# EasyEDA Pro project ProPrj_降压模块_2026-05-07.epro

# Schematic Schematic1
Board Name: Board1; Create Date: 2025-04-08; Page Name: P1; Project Name: 降压模块; Schematic Name: Schematic1; Update Date: 2025-04-08; Company: 嘉立创EDA; Drawed: 林海鑫; Page Size: A4; Version: V1.0
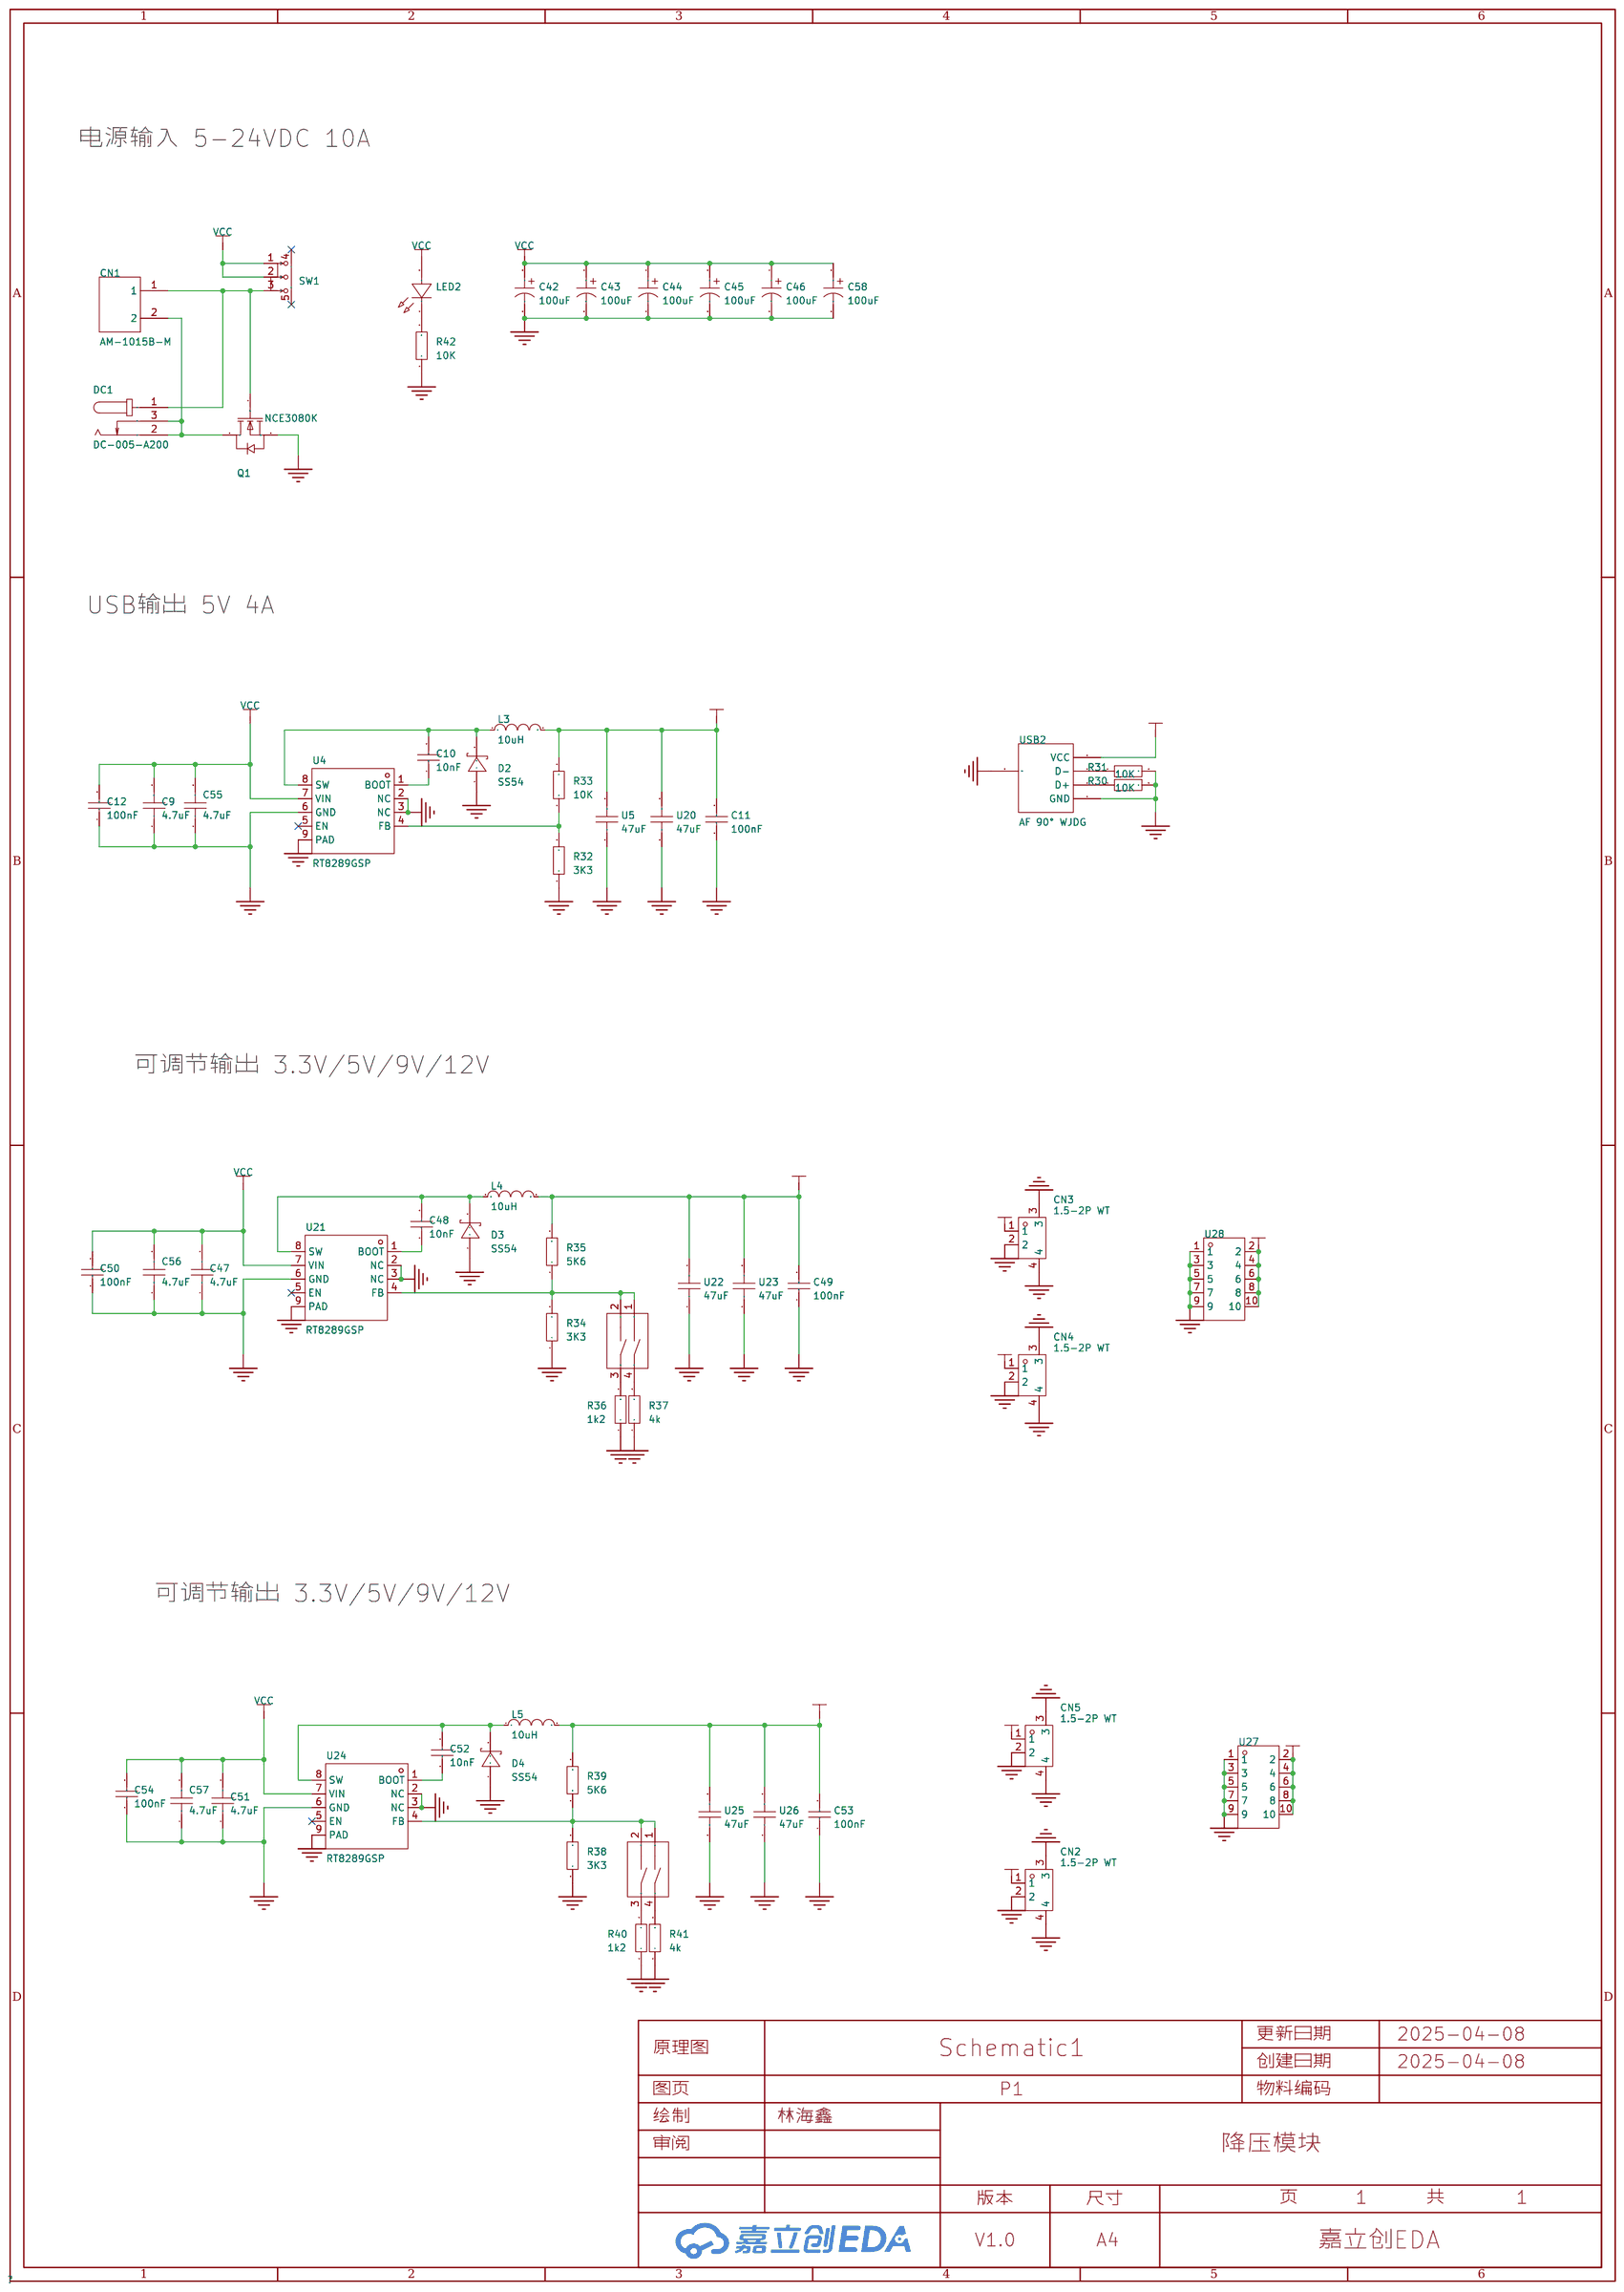
[diagram p0: schematic sheet]

## Parts
C9  4.7uF  [C1206]
C10  10nF  [C0603]
C11  100nF  [C0603]
C12  100nF  [C0603]
C42  100uF  [CAP-SMD_BD6.3-L6.6-W6.6-LS7.6-FD-1]
C43  100uF  [CAP-SMD_BD6.3-L6.6-W6.6-LS7.6-FD-1]
C44  100uF  [CAP-SMD_BD6.3-L6.6-W6.6-LS7.6-FD-1]
C45  100uF  [CAP-SMD_BD6.3-L6.6-W6.6-LS7.6-FD-1]
C46  100uF  [CAP-SMD_BD6.3-L6.6-W6.6-LS7.6-FD-1]
C47  4.7uF  [C1206]
C48  10nF  [C0603]
C49  100nF  [C0603]
C50  100nF  [C0603]
C51  4.7uF  [C1206]
C52  10nF  [C0603]
C53  100nF  [C0603]
C54  100nF  [C0603]
C55  4.7uF  [C1206]
C56  4.7uF  [C1206]
C57  4.7uF  [C1206]
C58  100uF  [CAP-SMD_BD6.3-L6.6-W6.6-LS7.6-FD-1]
CN1  AM-1015B-M  [CONN-TH_AM-1015B-M]
CN2  1.5-2P WT  [CONN-SMD_1.5-2P-WT]
CN3  1.5-2P WT  [CONN-SMD_1.5-2P-WT]
CN4  1.5-2P WT  [CONN-SMD_1.5-2P-WT]
CN5  1.5-2P WT  [CONN-SMD_1.5-2P-WT]
D2  SS54  [SMA_L4.4-W2.8-LS5.4-R-RD]
D3  SS54  [SMA_L4.4-W2.8-LS5.4-R-RD]
D4  SS54  [SMA_L4.4-W2.8-LS5.4-R-RD]
DC1  DC-005-A200  [DC-IN-TH_DC-005-A200]
L3  10uH  [IND-SMD_L7.3-W6.8]
L4  10uH  [IND-SMD_L7.3-W6.8]
L5  10uH  [IND-SMD_L7.3-W6.8]
LED2  XL-1608SURC-06  [LED0603-RD_RED]
Q1  NCE3080K  [TO-252-2_L6.6-W6.1-P4.57-LS9.9-TL-CW]
R30  10K  [R0603]
R31  10K  [R0603]
R32  3K3  [R0603]
R33  10K  [R0603]
R34  3K3  [R0603]
R35  5K6  [R0603]
R36  1k2  [R0603]
R37  4k  [R0603]
R38  3K3  [R0603]
R39  5K6  [R0603]
R40  1k2  [R0603]
R41  4k  [R0603]
R42  10K  [R0603]
SW1  SS-12D11L5  [SW-TH_SS-12D11L5]
SW2  DSHP02TSGER  [SW-SMD_DSHP02TSGER]
SW3  DSHP02TSGER  [SW-SMD_DSHP02TSGER]
U4  RT8289GSP  [SOIC-8_L5.0-W4.0-P1.27-LS6.0-BL-EP2.0]
U5  47uF  [C1206]
U20  47uF  [C1206]
U21  RT8289GSP  [SOIC-8_L5.0-W4.0-P1.27-LS6.0-BL-EP2.0]
U22  47uF  [C1206]
U23  47uF  [C1206]
U24  RT8289GSP  [SOIC-8_L5.0-W4.0-P1.27-LS6.0-BL-EP2.0]
U25  47uF  [C1206]
U26  47uF  [C1206]
U27  ZX-PZ2.54-2-5PZZ  [HDR-TH_10P-P2.54-V-M-R2-C5-S2.54]
U28  ZX-PZ2.54-2-5PZZ  [HDR-TH_10P-P2.54-V-M-R2-C5-S2.54]
USB2  AF 90° WJDG  [USB-A-TH_AF-WJDG]

## Library data of the parts
C9 C47 C51 C55-C57 = CL31B475KBHNNNE: 容值:4.7uF;精度:±10%;额定电压:50V;材质(温度系数):X7R;; LCSC Part Name: 4.7uF ±10% 50V; Supplier Part: C51205; Manufacturer: SAMSUNG(三星); Supplier Footprint: 1206; JLCPCB Part Class: Extended Part; Datasheet: https://atta.szlcsc.com/upload/public/pdf/source/20160218/1457707763339.pdf; Supplier: LCSC; Tolerance: ±10%; Voltage Rated: 50V; Temperature Coefficient: X7R
C10 C48 C52 = CC0603KRX7R9BB103: 容值:10nF;精度:±10%;额定电压:50V;材质(温度系数):X7R;; LCSC Part Name: 10nF ±10% 50V; Supplier Part: C100042; Manufacturer: YAGEO(国巨); Supplier Footprint: 0603; JLCPCB Part Class: Extended Part; Datasheet: https://atta.szlcsc.com/upload/public/pdf/source/20181008/C309510_22F155564471FAF6A489F7D68F34234E.pdf; Supplier: LCSC; Tolerance: ±10%; Voltage Rated: 50V; Temperature Coefficient: X7R
C11 C12 C49 C50 C53 C54 = CGA0603X7R104K500JT: 容值:100nF;精度:±10%;额定电压:50V;材质(温度系数):X7R;; LCSC Part Name: 100nF ±10% 50V; Supplier Part: C6119867; Manufacturer: HRE(芯声); Supplier Footprint: 0603; JLCPCB Part Class: Extended Part; Datasheet: https://atta.szlcsc.com/upload/public/pdf/source/20160218/1457707763339.pdf; Supplier: LCSC; Tolerance: ±10%; Voltage Rated: 50V; Temperature Coefficient: X7R
C42-C46 C58 = RVE100UF35V67RV0072: 容值:100uF;精度:±20%;额定电压:35V;纹波电流:230mA@120Hz;等效串联电阻:600mΩ@100kHz;; LCSC Part Name: 100uF ±20% 35V; Supplier Part: C2836437; Manufacturer: KNSCHA(科尼盛); Supplier Footprint: SMD,D6.3xL7.7mm; JLCPCB Part Class: 扩展库; Datasheet: https://atta.szlcsc.com/upload/public/pdf/source/20220719/B52EB46F8A1558448ED03D8B4CB3C24F.pdf; Supplier: LCSC; Tolerance: ±20%; Rated Voltage: 35V; Ripple Current: 230mA@120Hz; Equivalent Series Resistance(ESR): 600mΩ@100kHz; φD: 6.3mm; L: 7.7mm; Lifetime @ Temp: 2000hrs@105℃; Operating Temperature: -55℃~+105℃
CN1 = AM-1015B-M: 类别:-;类型1:-;; LCSC Part Name: AMASS(艾迈斯)电源连接器公头AM-1015B-M; Supplier Part: C90631; Manufacturer: AMASS(艾迈斯); JLCPCB Part Class: 扩展库; Datasheet: https://atta.szlcsc.com/upload/public/pdf/source/20161217/1481939174683.pdf; Supplier: LCSC; Brand: 艾迈斯; Type: T行插头; RatedVoltage: DC 500V; InterfaceType: 双公头; MetalMaterial: 铜镀金; InsulationMaterial: PA; RatedCurrent: 25A; RecommendedWireGauge: 12AWG; FlameRetardantGrade: UL94 V0; contact resistance: 0.45mΩ
CN2-CN5 = 1.5-2P WT: 插针结构:1x2P;间距:1.5mm;安装方式:卧贴;参考系列:ZH;总PIN数:2P;排数:1;每排PIN数:2;行距:-;额定电流:1A;工作温度范围:-25℃~+85℃;; Supplier Part: C2681533; Manufacturer: SHOU HAN(首韩); Supplier Footprint: SMD,P=1.5mm,卧贴; JLCPCB Part Class: Extended Part; Datasheet: https://atta.szlcsc.com/upload/public/pdf/source/20210107/C2681535_97741691CC21DAF8D9FC266F7E994B99.pdf; Supplier: LCSC; Pins Structure: 1x2P; Pitch: 1.5mm; Mounting Style: 卧贴; Reference Series: ZH; Number of Pins: 2P; Number of Rows: 1; Number of PINs Per Row: 2; Current Rating (Max): 1A; Operating Temperature Range: -25℃~+85℃
D2-D4 = SS54_C22452: 正向压降(Vf):550mV@5A;直流反向耐压(Vr):40V;平均整流电流(Io):5A;; LCSC Part Name: 电压:40V 电流:5A; Supplier Part: C22452; Manufacturer: MDD; Supplier Footprint: SMA(DO-214AC); JLCPCB Part Class: 基础库; Datasheet: https://atta.szlcsc.com/upload/public/pdf/source/20230314/529CD85F9B31F69841D3A079BC07E377.pdf; Supplier: LCSC; Forward Voltage (Vf@If): 550mV@5A; Reverse Voltage (Vr): 40V; Average Rectified Current (Io): 5A; Reverse Leakage Current (Ir): 1mA@40V
DC1 = DC-005-A200: 连接器类型:DC电源插座;安装方式:弯插;触点内径:2mm;触点外径:6.4mm;额定电流:3A;额定电压:30V;工作温度范围:-20℃~+70℃;; LCSC Part Name: DC电源插座 内径:2mm 外径:6.4mm; Supplier Part: C720557; Manufacturer: XUNPU(讯普); Supplier Footprint: 插件; JLCPCB Part Class: 扩展库; Datasheet: https://atta.szlcsc.com/upload/public/pdf/source/20200812/C720557_2286DFCD6C75B71AF905731F627ABF3A.pdf; Supplier: LCSC; Connector Type: DC电源插座; Mounting Style: 弯插; Inside Contact Diameter: 2mm; Outside Contact Diameter: 6.4mm; Current Rating (Max): 3A; Voltage Rating (Max): 30V; Operating Temperature Range: -20℃~+70℃
L3-L5 = FXL0630-100-M: 电感值:10uH;精度:±20%;额定电流:4.5A;饱和电流(Isat):5.5A;类型:一体成型电感;; LCSC Part Name: 10uH ±20% 5.5A; Supplier Part: C167223; Manufacturer: cjiang(长江微电); Supplier Footprint: SMD,6.6x7mm; JLCPCB Part Class: 扩展库; Datasheet: https://atta.szlcsc.com/upload/public/pdf/source/20240426/3189EA8206330E2108542F9E34E540E7.pdf; Supplier: LCSC; Tolerance: ±20%; Rated Current: 4.5A; Saturation Current (Isat): 5.5A; DC Resistance (DCR): 68mΩ; Type: 一体成型电感
LED2 = XL-1608SURC-06: 发光颜色:红色;功率:55mW;正向电流:25mA;主波长:617nm~621nm;透镜颜色:无色透明透镜;色温:-;发光角度:120°;载带方式:正贴;工作温度:-30℃~+85℃;; Supplier Part: C965799; Manufacturer: XINGLIGHT(成兴光); Supplier Footprint: 0603; JLCPCB Part Class: 扩展库; Datasheet: https://atta.szlcsc.com/upload/public/pdf/source/20221102/D860AFDD1CDB02C5A8064103A32707E2.pdf; Supplier: LCSC; Emitted Color: 红色; Power Dissipation: 55mW; Forward Current: 25mA; Dominant Wavelength: 617nm~621nm; Peak Wavelength: 623nm; Lens Color: 无色透明透镜; Viewing Angle: 120°; Mounting Sytle: 正贴; Operating Temperature: -30℃~+85℃
Q1 = NCE3080K: 类型:N沟道;漏源电压(Vdss):30V;连续漏极电流(Id):80A;功率(Pd):83W;导通电阻(RDS(on)@Vgs,Id):6.5mΩ@10V,30A;阈值电压(Vgs(th)@Id):3V@250uA;; LCSC Part Name: N沟道 耐压:30V 电流:80A; Supplier Part: C108901; Manufacturer: NCE(无锡新洁能); Supplier Footprint: TO-252-2(DPAK); JLCPCB Part Class: 扩展库; Datasheet: https://atta.szlcsc.com/upload/public/pdf/source/20170505/1493957853878.pdf; Supplier: LCSC; Type: N沟道; Drain Source Voltage (Vdss): 30V; Continuous Drain Current (Id): 80A; Power Dissipation (Pd): 83W; Drain Source On Resistance (RDS(on)@Vgs,Id): 6.5mΩ@10V,30A; Gate Threshold Voltage (Vgs(th)@Id): 3V@250uA
R30-R42 = Res_0603: Supplier Footprint: 0603
SW1 = SS-12D11L5: 电路结构:单刀双掷;安装方式:侧插;开关颜色:黑色;额定电流(DC):3A;额定电压(DC):125V;额定电流(AC):3A;额定电压(AC):125V;机械寿命:1万次;; LCSC Part Name: 柄长5mm 卧插双档 滑动开关; Supplier Part: C319010; Manufacturer: XKB Connectivity(中国星坤); Supplier Footprint: 插件; JLCPCB Part Class: 扩展库; Datasheet: https://atta.szlcsc.com/upload/public/pdf/source/20211009/84F89DEF741E27E9E55DE4039DC07CAD.pdf; Supplier: LCSC; Circuit: 单刀双掷; Actuator Style: 矩形柱状; Pin Style: PC引脚; Switch Length: 13.5mm; Switch Width: 6.6mm; Switch Height: 6.3mm; Mounting Style: 侧插; Actuator Color: 黑色; Current Rating (DC): 3A; Voltage Rating (DC): 125V; Current Rating (AC): 3A; Voltage Rating (AC): 125V; Mechanical Life: 1万次; Operating Temperature: -40℃~+85℃
SW2 SW3 = DSHP02TSGER_C3293142: 电路结构:单刀单掷;开关位数:2位;额定电流:25mA;额定电压:24V;使用寿命:3千次;颜色:黑色;; LCSC Part Name: 2位 1.27mm间距贴片型 KE拨码开关 编码开关; Supplier Part: C3293142; Manufacturer: 康深; Supplier Footprint: SMD-4P,4.1x5.4mm; JLCPCB Part Class: 扩展库; Datasheet: https://atta.szlcsc.com/upload/public/pdf/source/20220713/5EFC25369A61FE3CF74296177B6F914F.pdf; Supplier: LCSC; Circuit: 单刀单掷; Number of Positions: 2位; Lead Pitch: 1.27mm; Current Rating: 25mA; Voltage Rating: 24V; Operating Temperature: -30℃~+85℃; Operating Life: 3千次; Color: 黑色
U4 U21 U24 = RT8289GSP: 功能类型:降压型;输出类型:可调;输入电压:5.5V~32V;输出电压:1.222V~26V;输出电流(最大值):5A;; Supplier Part: C39202; Manufacturer: RICHTEK(立锜); Supplier Footprint: SOIC-8-EP; JLCPCB Part Class: 扩展库; Datasheet: https://atta.szlcsc.com/upload/public/pdf/source/20141219/1457707253176.pdf; Supplier: LCSC; Function: 降压型; Output Type: 可调; Input Voltage: 5.5V~32V; Output Voltage: 1.222V~26V; Output Current (Max): 5A; Switching Frequency: 500kHz; Operating Temperature: -40℃~+85℃@(TA); Synchronous Rectification: 否; Number of Outputs: 1; Topology: 降压式; Switch tube (built-in/external): 内置
U5 U20 U22 U23 U25 U26 = CL31A476MPHNNNE: 容值:47uF;精度:±20%;额定电压:10V;材质(温度系数):X5R;; LCSC Part Name: 47uF ±20% 10V; Supplier Part: C96123; Manufacturer: SAMSUNG(三星); Supplier Footprint: 1206; JLCPCB Part Class: Basic Part; Datasheet: https://atta.szlcsc.com/upload/public/pdf/source/20160218/1457707763339.pdf; Supplier: LCSC; Tolerance: ±20%; Voltage Rated: 10V; Temperature Coefficient: X5R
U27 U28 = ZX-PZ2.54-2-5PZZ: 插针结构:2x5P;间距:2.54mm;行距:2.54mm;圆针/方针:方针;安装类型:直插;排数:双排;总PIN位数:10P;额定电流:3A;额定电压:1kV;配合针长度:6mm;塑高:2.5mm;端接针长度:3mm;触头材质:黄铜;触头镀层:金;工作温度范围:-40℃~+105℃;焊接温度(最大值):-;颜色:黑色;; LCSC Part Name: 2x5P 间距:2.54mm 方针 直插; Supplier Part: C7501276; Manufacturer: Megastar(兆星); Supplier Footprint: 插件,P=2.54mm; JLCPCB Part Class: Extended Part; Datasheet: https://atta.szlcsc.com/upload/public/pdf/source/20231122/7DD2FA5A7FDBC10CDDB6051CB6BC6AD1.pdf; Supplier: LCSC; Pin Structure: 2x5P; Pitch: 2.54mm; Row Spacing: 2.54mm; Circluar Pins/Square Pins: 方针; Mounting Type: 直插; Number of Rows: 双排; Number of Pins: 10P; Current Rating (Max): 3A; Voltage Rating (Max): 1kV; Length of Mating Pin: 6mm; Insulation Height: 2.5mm; Length of End Connection Pin: 3mm; Contact Material: 黄铜; Contact Plating: 金; Operating Temperature Range: -40℃~+105℃; Color: 黑色
USB2 = AF 90° WJDG: 连接器类型:Type-A;标准:USB 2.0;公母:母;端口数量:1;触点数量:4P;安装方式:弯插;额定电流 - 电源:1.5A;工作温度范围:-25℃~+85℃;; LCSC Part Name: Type-A 母 弯插; Supplier Part: C456018; Manufacturer: SHOU HAN(首韩); Supplier Footprint: 插件; JLCPCB Part Class: 扩展库; Datasheet: https://atta.szlcsc.com/upload/public/pdf/source/20191113/C456018_B104E062BEB8E11E57E63560E04EE13A.pdf; Supplier: LCSC; Connector Type: Type-A; Standard: USB 2.0; Gender: 母; Number of Ports: 1; Number of Contacts: 4P; Mounting Style: 弯插; Current Rating - Power (Max): 1.5A; Operating Temperature Range: -25℃~+85℃

## Nets
5V_USB: C11.2 L3.2 R33.2 U5.2 U20.2 USB2.1(VCC)
GND: C9.1 C11.1 C12.1 C42.2 C43.2 C44.2 C45.2 C46.2 C47.1 C49.1 C50.1 C51.1 C53.1 C54.1 C55.1 C56.1 C57.1 C58.2 CN2.2 CN2.3 CN2.4 CN3.2 CN3.3 CN3.4 CN4.2 CN4.3 CN4.4 CN5.2 CN5.3 CN5.4 D2.1(A) D3.1(A) D4.1(A) Q1.3(S) R30.2 R31.2 R32.1 R34.1 R36.1 R37.1 R38.1 R40.1 R41.1 R42.1 U4.2(NC) U4.3(NC) U4.6(GND) U4.9(PAD) U5.1 U20.1 U21.2(NC) U21.3(NC) U21.6(GND) U21.9(PAD) U22.1 U23.1 U24.2(NC) U24.3(NC) U24.6(GND) U24.9(PAD) U25.1 U26.1 U27.1 U27.3 U27.5 U27.7 U27.9 U28.1 U28.3 U28.5 U28.7 U28.9 USB2.4(GND) USB2.5(SHLD)
VCC: C9.2 C12.2 C42.1 C43.1 C44.1 C45.1 C46.1 C47.2 C50.2 C51.2 C54.2 C55.2 C56.2 C57.2 C58.1 LED2.2(A) SW1.1 SW1.2 U4.7(VIN) U21.7(VIN) U24.7(VIN)
VOUT1: C49.2 CN3.1 CN4.1 L4.2 R35.2 U22.2 U23.2 U28.2 U28.4 U28.6 U28.8 U28.10
VOUT2: C53.2 CN2.1 CN5.1 L5.2 R39.2 U25.2 U26.2 U27.2 U27.4 U27.6 U27.8 U27.10
$1N564: C10.2 D2.2(K) L3.1 U4.8(SW)
$1N565: C10.1 U4.1(BOOT)
$1N567: R32.2 R33.1 U4.4(FB)
$1N2303: R30.1 USB2.2(D-)
$1N2305: R31.1 USB2.3(D+)
$1N2402: CN1.2 DC1.2 DC1.3 Q1.2(D)
$1N3604: C48.2 D3.2(K) L4.1 U21.8(SW)
$1N3605: C48.1 U21.1(BOOT)
$1N3723: R34.2 R35.1 SW2.1 SW2.2 U21.4(FB)
$1N4431: C52.2 D4.2(K) L5.1 U24.8(SW)
$1N4432: C52.1 U24.1(BOOT)
$1N4442: R38.2 R39.1 SW3.1 SW3.2 U24.4(FB)
$1N7399: CN1.1 DC1.1 Q1.1(G) SW1.3
$1N8296: R40.2 SW3.3
$1N8298: R41.2 SW3.4
$1N8344: R36.2 SW2.3
$1N8346: R37.2 SW2.4
$1N8653: LED2.1(K) R42.2

Not connected (* = marked no-connect by the designer): SW1 4* 5*; U4 5(EN)*; U21 5(EN)*; U24 5(EN)*

## Notes on the sheet
- 电源输入 5-24VDC 10A
- USB输出 5V 4A
- 可调节输出 3.3V/5V/9V/12V
- 可调节输出 3.3V/5V/9V/12V

# Board PCB1
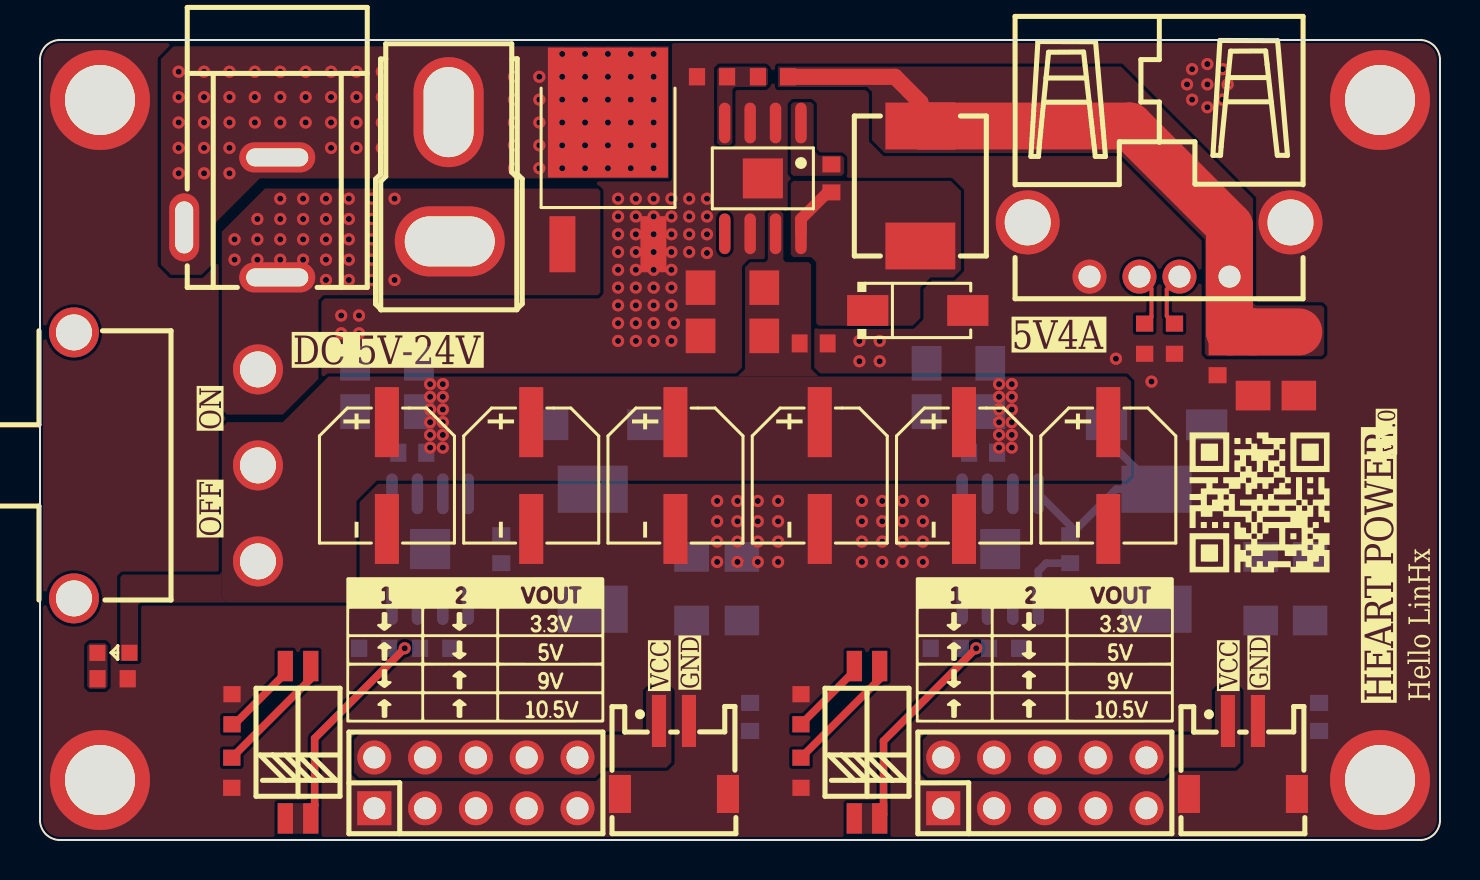
[diagram p1: board, top side]
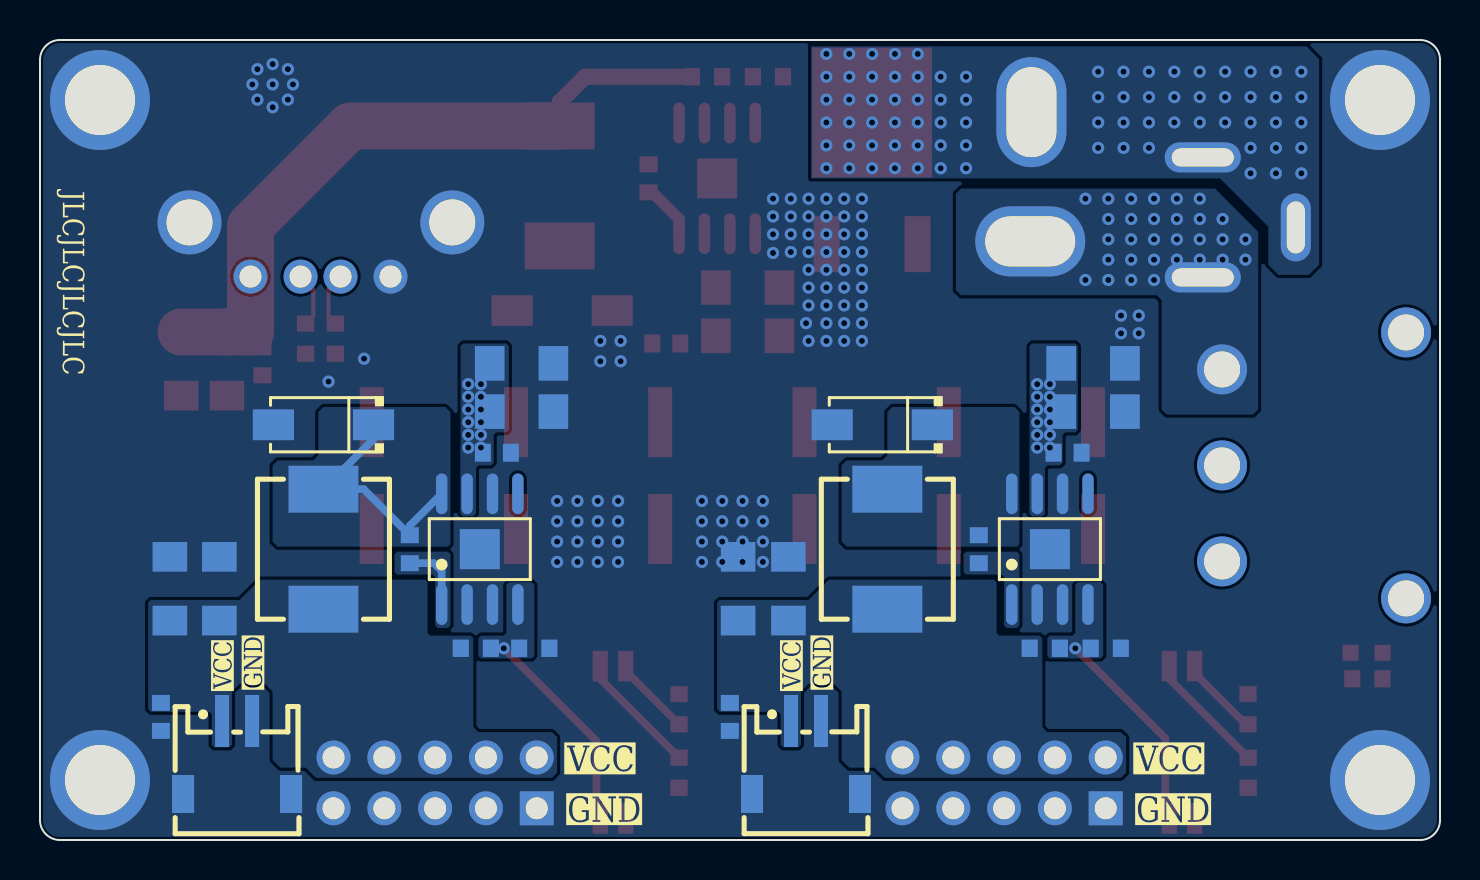
[diagram p2: board, bottom side, seen from below]

Outline 70 x 40 mm; copper layers: Top Layer, Bottom Layer. Coordinates in mm from the lower left corner of the outline.
Outline path: 0,39 arc(0.29,39.71) 1,40 69,40 arc(69.71,39.71) 70,39 70,1 arc(69.71,0.29) 69,0 1,0 arc(0.29,0.29) 0,1 0,39
Stack: Top Layer 0.035mm - / Dielectric1 1.51mm FR4 er 4.5 / Bottom Layer 0.035mm -

## Design rules (mm)
net $1N2305: DP1
net $1N2303: DP1
template: 自定义配置
spacing copperThickness1oz (default): track to track 0.102, other pairs 0.152 to 0.3
spacing copperThickness2oz: track to track 0.203, other pairs 0.152 to 0.3
track width copperThickness1oz (default): min 0.127, default 0.254, max 2.54
track width copperThickness2oz: min 0.203, default 0.254, max 2.54
differential pair differentialPair (default): width min 0.127, default 0.254, max 2.54; gap min 0.152, default 0.152
via viaSize (default): diameter min 0.5, default 0.61, max 10; hole min 0.3, default 0.305, max 6.3
pour e767 uses copperRegion

## Placement (name value [footprint] x y rotation side)
C9  4.7uF  [C1206]  34.62 25.21 0 top
C10  10nF  [C0603]  39.57 33.08 270 top
C11  100nF  [C0603]  58.88 23.94 90 top
C12  100nF  [C0603]  38.68 24.83 180 top
C42  100uF  [CAP-SMD_BD6.3-L6.6-W6.6-LS7.6-FD-1]  46.2 18.22 270 top
C43  100uF  [CAP-SMD_BD6.3-L6.6-W6.6-LS7.6-FD-1]  24.56 18.22 270 top
C44  100uF  [CAP-SMD_BD6.3-L6.6-W6.6-LS7.6-FD-1]  31.77 18.22 270 top
C45  100uF  [CAP-SMD_BD6.3-L6.6-W6.6-LS7.6-FD-1]  17.35 18.22 270 top
C46  100uF  [CAP-SMD_BD6.3-L6.6-W6.6-LS7.6-FD-1]  38.99 18.22 270 top
C47  4.7uF  [C1206]  45.92 21.42 0 bottom
C48  10nF  [C0603]  51.51 14.54 90 bottom
C49  100nF  [C0603]  63.96 6.16 90 bottom
C50  100nF  [C0603]  47.16 19.36 0 bottom
C51  4.7uF  [C1206]  17.35 21.42 0 bottom
C52  10nF  [C0603]  23.06 14.54 90 bottom
C53  100nF  [C0603]  35.51 6.16 90 bottom
C54  100nF  [C0603]  18.62 19.36 0 bottom
C55  4.7uF  [C1206]  34.62 27.62 0 top
C56  4.7uF  [C1206]  45.92 23.83 0 bottom
C57  4.7uF  [C1206]  17.35 23.83 0 bottom
C58  100uF  [CAP-SMD_BD6.3-L6.6-W6.6-LS7.6-FD-1]  53.41 18.22 270 top
CN1  AM-1015B-M  [CONN-TH_AM-1015B-M]  20.46 33.16 90 top
CN2  1.5-2P WT  [CONN-SMD_1.5-2P-WT]  31.7 4.13 180 top
CN3  1.5-2P WT  [CONN-SMD_1.5-2P-WT]  60.15 4.12 0 bottom
CN4  1.5-2P WT  [CONN-SMD_1.5-2P-WT]  60.15 4.12 180 top
CN5  1.5-2P WT  [CONN-SMD_1.5-2P-WT]  31.7 4.13 0 bottom
D2  SS54  [SMA_L4.4-W2.8-LS5.4-R-RD]  43.89 26.48 0 top
D3  SS54  [SMA_L4.4-W2.8-LS5.4-R-RD]  55.83 20.76 0 bottom
D4  SS54  [SMA_L4.4-W2.8-LS5.4-R-RD]  27.89 20.76 0 bottom
DC1  DC-005-A200  [DC-IN-TH_DC-005-A200]  9.54 31.13 270 top
L3  10uH  [IND-SMD_L7.3-W6.8]  44.02 32.7 90 top
L4  10uH  [IND-SMD_L7.3-W6.8]  55.83 14.54 270 bottom
L5  10uH  [IND-SMD_L7.3-W6.8]  27.63 14.54 270 bottom
LED2  XL-1608SURC-06  [LED0603-RD_RED]  3.67 9.36 0 top
NOREF  -  [Pad_e680]  3 3 0 top
NOREF#2  -  [Pad_e681]  67 3 0 top
NOREF#3  -  [Pad_e679]  3 37 0 top
NOREF#4  -  [Pad_e678]  67 37 0 top
Q1  NCE3080K  [TO-252-2_L6.6-W6.1-P4.57-LS9.9-TL-CW]  28.4 33.08 90 top
R30  10K  [R0603]  56.72 25.07 270 top
R31  10K  [R0603]  55.23 25.07 270 top
R32  3K3  [R0603]  33.6 38.16 0 top
R33  10K  [R0603]  36.65 38.16 0 top
R34  3K3  [R0603]  45.29 9.59 0 bottom
R35  5K6  [R0603]  48.21 9.59 0 bottom
R36  1k2  [R0603]  38.05 3.36 90 top
R37  4k  [R0603]  38.05 6.54 270 top
R38  3K3  [R0603]  16.71 9.59 0 bottom
R39  5K6  [R0603]  19.76 9.59 0 bottom
R40  1k2  [R0603]  9.59 3.36 90 top
R41  4k  [R0603]  9.6 6.54 270 top
R42  10K  [R0603]  3.63 8.06 180 top
SW1  SS-12D11L5  [SW-TH_SS-12D11L5]  6.3 18.73 90 top
SW2  DSHP02TSGER  [SW-SMD_DSHP02TSGER]  41.35 4.89 0 top
SW3  DSHP02TSGER  [SW-SMD_DSHP02TSGER]  12.9 4.89 0 top
U4  RT8289GSP  [SOIC-8_L5.0-W4.0-P1.27-LS6.0-BL-EP2.0]  36.14 33.08 180 top
U5  47uF  [C1206]  62.94 23.81 90 top
U20  47uF  [C1206]  60.65 23.81 90 top
U21  RT8289GSP  [SOIC-8_L5.0-W4.0-P1.27-LS6.0-BL-EP2.0]  48.01 14.54 180 bottom
U22  47uF  [C1206]  61.03 12.56 270 bottom
U23  47uF  [C1206]  63.51 12.56 270 bottom
U24  RT8289GSP  [SOIC-8_L5.0-W4.0-P1.27-LS6.0-BL-EP2.0]  19.51 14.54 180 bottom
U25  47uF  [C1206]  35.1 12.56 270 bottom
U26  47uF  [C1206]  32.58 12.56 270 bottom
U27  ZX-PZ2.54-2-5PZZ  [HDR-TH_10P-P2.54-V-M-R2-C5-S2.54]  21.8 2.86 0 top
U28  ZX-PZ2.54-2-5PZZ  [HDR-TH_10P-P2.54-V-M-R2-C5-S2.54]  50.24 2.86 0 top
USB2  AF 90° WJDG  [USB-A-TH_AF-WJDG]  55.96 29.53 180 top

## Footprints (pads in the part's own frame, mm; a bottom-side part is the same pattern mirrored in y, then rotated)
C0603
  rect 0.8x0.9 smd: 1(-0.7,0) 2(0.7,0)
C1206
  rect 1.485x1.728 smd: 1(-1.593,0) 2(1.593,0)
CAP-SMD_BD6.3-L6.6-W6.6-LS7.6-FD-1
  rect 3.5x1.2 smd: 1(-2.67,0) 2(2.67,0)
CONN-SMD_1.5-2P-WT
  rect 0.7x2.6 smd: 1(0.75,-1.825) 2(-0.75,-1.825)
  rect 1.1x1.9 smd: 3(-2.7,1.825) 4(2.7,1.825)
CONN-TH_AM-1015B-M
  oval 3.5x5.5 hole 2.5x4.5: 1(-3.231,-0.029)
  oval 5.5x3.5 hole 4.5x2.5: 2(3.231,0.029)
DC-IN-TH_DC-005-A200
  oval 1.5x3.8 hole 0.9x3.1: 1(3,2.325) 2(-3,2.325)
  oval 3.4x1.5 hole 2.6x0.9: 3(0.5,-2.325)
HDR-TH_10P-P2.54-V-M-R2-C5-S2.54
  rect 1.7x1.7 hole 1.1: 1(-5.08,-1.27)
  round 1.7 hole 1.1: 2(-5.08,1.27) 3(-2.54,-1.27) 4(-2.54,1.27) 5(0,-1.27) 6(0,1.27) 7(2.54,-1.27) 8(2.54,1.27) 9(5.08,-1.27) 10(5.08,1.27)
IND-SMD_L7.3-W6.8
  rect 2.35x3.5 smd: 1(-3,0) 2(3,0)
LED0603-RD_RED
  rect 0.8x0.8 smd: 1(-0.799,-0.004) 2(0.799,0.004)
Pad_e678
  round 5 hole 3.5: 11(0,0)
Pad_e679
  round 5 hole 3.5: 12(0,0)
Pad_e680
  round 5 hole 3.5: 13(0,0)
Pad_e681
  round 5 hole 3.5: 14(0,0)
R0603
  rect 0.806x0.864 smd: 1(-0.753,0) 2(0.753,0)
SMA_L4.4-W2.8-LS5.4-R-RD
  rect 2.062x1.539 smd: 1(2.503,0) 2(-2.503,0)
SOIC-8_L5.0-W4.0-P1.27-LS6.0-BL-EP2.0
  oval 0.574x2.038 smd: 1(-1.905,-2.769) 2(-0.635,-2.769) 3(0.635,-2.769) 4(1.905,-2.769) 5(1.905,2.769) 6(0.635,2.769) 7(-0.635,2.769) 8(-1.905,2.769)
  rect 2x2 smd: 9(0,0)
SW-SMD_DSHP02TSGER
  rect 0.762x1.524 smd: 1(-0.635,-3.81) 2(0.635,-3.81) 3(0.635,3.81) 4(-0.635,3.81)
SW-TH_SS-12D11L5
  round 2.5 hole 1.8: 1(-4.8,-4.6) 2(0,-4.6) 3(4.8,-4.6) 4(-6.65,4.6) 5(6.65,4.6)
TO-252-2_L6.6-W6.1-P4.57-LS9.9-TL-CW
  rect 2.8x1.3 smd: 1(-3.292,2.273) 3(-3.292,-2.273)
  rect 6.5x6 smd: 2(3.292,0)
USB-A-TH_AF-WJDG
  round 1.7 hole 1.1: 1(-3.521,1.355) 2(-1.018,1.355) 3(0.981,1.355) 4(3.48,1.355)
  round 3.2 hole 2.3: 5(-6.57,-1.355) 5(6.57,-1.355)

## Nets
As in the schematic, except:
GND: C9.1 C11.1 C12.1 C42.2 C43.2 C44.2 C45.2 C46.2 C47.1 C49.1 C50.1 C51.1 C53.1 C54.1 C55.1 C56.1 C57.1 C58.2 CN2.2 CN2.3 CN2.4 CN3.2 CN3.3 CN3.4 CN4.2 CN4.3 CN4.4 CN5.2 CN5.3 CN5.4 D2.1 D3.1 D4.1 NOREF.13 NOREF#2.14 NOREF#3.12 NOREF#4.11 Q1.3 R30.2 R31.2 R32.1 R34.1 R36.1 R37.1 R38.1 R40.1 R41.1 R42.1 U4.2 U4.3 U4.6 U4.9 U5.1 U20.1 U21.2 U21.3 U21.6 U21.9 U22.1 U23.1 U24.2 U24.3 U24.6 U24.9 U25.1 U26.1 U27.1 U27.3 U27.5 U27.7 U27.9 U28.1 U28.3 U28.5 U28.7 U28.9 USB2.4 USB2.5

Pads without a net: SW1 4 5; U4 5; U21 5; U24 5

## Via types
v1: diameter 0.61, hole 0.305, Top Layer to Bottom Layer, 227 vias

## Routing (per net, layer and track width the routed paths; a pad name or vN(x,y) marks a point on that pad's centre or on a via; arc(x,y) is an arc through that point)
5V_USB: length 34.6
  Top Layer w0.807: L3.2 44.02,36.89 42.75,38.16 R33.2
  Top Layer w2.349: L3.2 54.48,35.7 59.48,30.7 USB2.1 59.48,25.4 U20.2 U5.2
GND:
  vias: v1(15.06,26.22) v1(15.06,25.33) v1(15.95,26.22) v1(15.95,25.33) v1(28.9,32.06) v1(28.9,31.18) v1(28.9,30.29) v1(28.9,29.4) v1(28.9,28.51) v1(28.9,27.62) v1(28.9,26.73) v1(28.9,25.84) v1(28.9,24.95) v1(29.79,32.06) v1(29.79,31.18) v1(29.79,30.29) v1(29.79,29.4) v1(29.79,28.51) v1(29.79,27.62) v1(29.79,26.73) v1(29.79,25.84) v1(29.79,24.95) v1(30.68,32.06) v1(30.68,31.18) v1(30.68,30.29) v1(30.68,29.4) v1(30.68,28.51) v1(30.68,27.62) v1(30.68,26.73) v1(30.68,25.84) v1(30.68,24.95) v1(31.57,32.06) v1(31.57,31.18) v1(31.57,30.29) v1(31.57,29.4) v1(31.57,28.51) v1(31.57,27.62) v1(31.57,26.73) v1(31.57,24.95) v1(31.7,25.84) v1(32.46,32.06) v1(32.46,31.18) v1(32.46,30.29) v1(32.46,29.4) v1(33.35,32.06) v1(33.35,31.18) v1(33.35,30.29) v1(33.35,29.35) v1(33.86,16.95) v1(33.86,15.94) v1(33.86,14.92) v1(33.86,13.9) v1(34.87,16.95) v1(34.87,15.94) v1(34.87,14.92) v1(34.87,13.9) v1(35.89,16.95) v1(35.89,15.94) v1(35.89,14.92) v1(35.89,13.9) v1(36.91,16.95) v1(36.91,15.94) v1(36.91,14.92) v1(36.91,13.9) v1(40.97,24.95) v1(40.97,23.94) v1(41.1,16.95) v1(41.1,15.94) v1(41.1,14.92) v1(41.1,13.9) v1(41.99,24.95) v1(41.99,23.94) v1(42.11,16.95) v1(42.11,15.94) v1(42.11,14.92) v1(42.11,13.9) v1(43.13,16.95) v1(43.13,15.94) v1(43.13,14.92) v1(43.13,13.9) v1(44.14,16.95) v1(44.14,15.94) v1(44.14,14.92) v1(44.14,13.9) v1(53.8,24.06) v1(55.57,22.92) v1(57.35,37.78) v1(57.61,38.54) v1(57.61,37.02) v1(58.37,38.8) v1(58.37,37.78) v1(58.37,36.64) v1(59.13,38.54) v1(59.13,37.02) v1(59.38,37.78)
VCC:
  vias: v1(19.51,22.79) v1(19.51,22.16) v1(19.51,21.52) v1(19.51,20.89) v1(19.51,20.25) v1(19.51,19.62) v1(20.14,22.79) v1(20.14,22.16) v1(20.14,21.52) v1(20.14,20.89) v1(20.14,20.25) v1(20.14,19.62) v1(47.95,22.79) v1(47.95,22.16) v1(47.95,21.52) v1(47.95,20.89) v1(47.95,20.25) v1(47.95,19.62) v1(48.59,22.79) v1(48.59,22.16) v1(48.59,21.52) v1(48.59,20.89) v1(48.59,20.25) v1(48.59,19.62)
$1N564: length 2.7
  Top Layer w0.574: U4.8 38.05,31.05 39.38,32.38 39.44,32.38
$1N2303: length 2.8
  Top Layer w0.203: USB2.2 56.34,27.53 56.34,26.21 R30.1
$1N2305: length 2.7
  Top Layer w0.203: USB2.3 55.57,27.57 55.57,26.16 R31.1
$1N2402:
  vias: v1(6.93,38.42) v1(6.93,37.14) v1(6.93,35.88) v1(6.93,34.61) v1(6.93,33.33) v1(8.2,38.42) v1(8.2,37.14) v1(8.2,35.88) v1(8.2,34.61) v1(8.2,33.33) v1(9.47,38.42) v1(9.47,37.14) v1(9.47,35.88) v1(9.47,34.61) v1(9.47,33.33) v1(10.74,38.42) v1(10.74,37.14) v1(10.74,35.88) v1(12.01,38.42) v1(12.01,37.14) v1(12.01,35.88) v1(13.28,38.42) v1(13.28,37.14) v1(13.28,35.88) v1(14.55,38.42) v1(14.55,37.14) v1(14.55,35.88) v1(14.55,34.61) v1(15.82,38.42) v1(15.82,37.14) v1(15.82,35.88) v1(15.82,34.61) v1(17.09,38.42) v1(17.09,37.14) v1(17.09,35.88) v1(17.09,34.61) v1(23.7,38.16) v1(23.7,37.02) v1(23.7,35.88) v1(23.7,34.73) v1(23.7,33.59) v1(24.97,38.16) v1(24.97,37.02) v1(24.97,35.88) v1(24.97,34.73) v1(24.97,33.59) v1(26.11,39.3) v1(26.11,38.16) v1(26.11,37.02) v1(26.11,35.88) v1(26.11,34.73) v1(26.11,33.59) v1(27.25,39.3) v1(27.25,38.16) v1(27.25,37.02) v1(27.25,35.88) v1(27.25,34.73) v1(27.25,33.59) v1(28.4,39.3) v1(28.4,38.16) v1(28.4,37.02) v1(28.4,35.88) v1(28.4,34.73) v1(28.4,33.59) v1(29.54,39.3) v1(29.54,38.16) v1(29.54,37.02) v1(29.54,35.88) v1(29.54,34.73) v1(29.54,33.59) v1(30.68,39.3) v1(30.68,38.16) v1(30.68,37.02) v1(30.68,35.88) v1(30.68,34.73) v1(30.68,33.59)
$1N3604: length 12.3
  Bottom Layer w0.381: U21.8 51.51,15.72 C48.2 53.81,17.54 L4.1 53.32,20.04 D3.2
$1N3605: length 3.4
  Bottom Layer w0.381: C48.1 50.3,13.84 49.91,13.45 U21.1
$1N3723: length 10.5
  Top Layer w0.381: v1(46.81,9.59) 42.18,4.95 42.18,1.27 SW2.2
$1N4442: length 10
  Top Layer w0.381: v1(18.24,9.59) 13.73,5.08 13.73,1.72 13.55,1.54
$1N7399:
  vias: v1(9.73,30.03) v1(9.73,29.02) v1(10.87,31.05) v1(10.87,30.03) v1(10.87,29.02) v1(12.01,32.06) v1(12.01,31.05) v1(12.01,30.03) v1(12.01,29.02) v1(13.16,32.06) v1(13.16,31.05) v1(13.16,30.03) v1(13.16,29.02) v1(14.3,32.06) v1(14.3,31.05) v1(14.3,30.03) v1(14.3,29.02) v1(14.3,28) v1(15.44,32.06) v1(15.44,31.05) v1(15.44,30.03) v1(15.44,29.02) v1(15.44,28) v1(16.59,32.06) v1(16.59,31.05) v1(16.59,30.03) v1(16.59,29.02) v1(16.59,28) v1(17.73,32.06) v1(17.73,28)
$1N8296: length 6.3
  Top Layer w0.381: 9.59,4.12 13.65,8.18 13.65,8.58 SW3.3
$1N8298: length 4.1
  Top Layer w0.381: SW3.4 12.27,8.34 9.72,5.78 R41.2
$1N8344: length 6.3
  Top Layer w0.381: SW2.3 42.06,8.62 42.06,8.13 R36.2
$1N8346: length 4.1
  Top Layer w0.381: R37.2 40.84,8.57 SW2.4

## Copper pours and planes (outline as drawn; the poured copper is in the pictures)
5V_USB on Top Layer: 36.91,38.67 64.21,38.67 64.21,24.19 36.91,24.19
GND on Top Layer: 35,36.89 37.29,36.89 37.29,29.14 35,29.14
GND on Top Layer: 15.7,7.55 35.13,7.55 35.13,0.31 15.7,0.31
GND on Top Layer: 44.14,7.55 63.57,7.55 63.57,0.31 44.14,0.31
GND on Top Layer: 14.17,34.48 35.13,34.48 35.13,23.43 14.17,23.43
GND on Top Layer: 31.82,39.69 33.48,39.69 33.48,34.48 31.82,34.48
GND on Top Layer: 47.06,33.33 51.64,33.33 51.64,28.64 47.06,28.64
GND on Top Layer: 59.51,23.94 64.08,23.94 64.08,20.76 59.51,20.76
GND on Top Layer: 50.88,29.53 53.67,29.53 53.67,26.6 50.88,26.6
GND on Top Layer: 16.08,17.71 54.56,17.71 54.56,13.27 16.08,13.27
GND on Top Layer: 0,39 0.29,39.71 1,40 69,40 69.71,39.71 70,39 70,1 69.71,0.29 69,0 1,0 0.29,0.29 0,1
GND on Bottom Layer: 0,39 0.29,39.71 1,40 69,40 69.71,39.71 70,39 70,1 69.71,0.29 69,0 1,0 0.29,0.29 0,1
GND on Bottom Layer: 31.32,15.43 36.52,15.43 36.52,12.89 31.32,12.89
GND on Bottom Layer: 44.14,6.16 64.59,6.16 64.59,0.31 44.14,0.31
GND on Bottom Layer: 46.94,18.48 49.22,18.48 49.22,10.6 46.94,10.6
GND on Bottom Layer: 59.89,15.3 64.84,15.3 64.84,13.02 59.89,13.02
GND on Bottom Layer: 58.62,7.55 60.4,7.55 60.4,3.87 58.62,3.87
GND on Bottom Layer: 15.7,6.16 36.14,6.16 36.14,0.31 15.7,0.31
GND on Bottom Layer: 18.49,18.48 20.78,18.48 20.78,10.6 18.49,10.6
GND on Bottom Layer: 30.17,7.55 31.95,7.55 31.95,3.87 30.17,3.87
GND on Bottom Layer: 43.38,24.83 45.79,24.83 45.79,20.13 43.38,20.13
VCC on Top Layer: 9.09,23.17 54.56,23.17 54.56,11.87 9.09,11.87
VCC on Top Layer: 36.4,31.43 37.16,31.43 37.16,26.73 36.4,26.73
VCC on Top Layer: 34.87,31.43 38.94,31.43 38.94,23.17 34.87,23.17
VCC on Top Layer: 4.01,13.4 9.35,13.4 9.35,8.95 4.01,8.95
VCC on Bottom Layer: 18.11,24.83 20.52,24.83 20.52,16.19 18.11,16.19
VCC on Bottom Layer: 19.76,19.75 20.52,19.75 20.52,16.19 19.76,16.19
VCC on Bottom Layer: 48.21,19.75 48.97,19.75 48.97,16.19 48.21,16.19
VCC on Bottom Layer: 46.56,24.83 48.97,24.83 48.97,16.19 46.56,16.19
VOUT1 on Top Layer: 44.14,7.55 60.02,7.55 60.02,3.11 44.14,3.11
VOUT1 on Bottom Layer: 44.14,13.02 64.59,13.02 64.59,3.11 44.14,3.11
VOUT1 on Bottom Layer: 48.08,13.02 54.18,13.02 54.18,5.39 48.08,5.39
VOUT2 on Top Layer: 15.7,7.55 31.57,7.55 31.57,3.11 15.7,3.11
VOUT2 on Bottom Layer: 19.63,13.02 25.73,13.02 25.73,5.39 19.63,5.39
VOUT2 on Bottom Layer: 15.7,13.02 36.14,13.02 36.14,3.11 15.7,3.11
$1N564 on Top Layer: 37.54,32.95 46.05,32.95 46.05,25.72 37.54,25.72
$1N565 on Top Layer: 37.54,36.89 40.21,36.89 40.21,33.21 37.54,33.21
$1N567 on Top Layer: 33.86,38.67 36.4,38.67 36.4,34.73 33.86,34.73
$1N2402 on Top Layer: 6.04,39.69 31.44,39.69 31.44,28.25 6.04,28.25
$1N2402 on Bottom Layer: 6.04,39.69 31.44,39.69 31.44,28.25 6.04,28.25
$1N3604 on Bottom Layer: 49.48,21.65 58.37,21.65 58.37,14.67 49.48,14.67
$1N3605 on Bottom Layer: 49.48,14.41 52.27,14.41 52.27,10.6 49.48,10.6
$1N3723 on Top Layer: 40.33,1.84 42.37,1.84 42.37,0.31 40.33,0.31
$1N3723 on Bottom Layer: 45.29,12.89 48.08,12.89 48.08,9.08 45.29,9.08
$1N4431 on Bottom Layer: 21.03,21.65 29.92,21.65 29.92,14.67 21.03,14.67
$1N4432 on Bottom Layer: 21.03,14.41 23.82,14.41 23.82,10.6 21.03,10.6
$1N4442 on Top Layer: 11.89,1.84 13.92,1.84 13.92,0.31 11.89,0.31
$1N4442 on Bottom Layer: 16.84,12.89 19.63,12.89 19.63,9.08 16.84,9.08
$1N7399 on Top Layer: 9.09,32.57 28.01,32.57 28.01,21.27 9.09,21.27
$1N7399 on Bottom Layer: 9.09,32.57 24.21,32.57 24.21,21.27 9.09,21.27
$1N8653 on Top Layer: 2.36,9.84 3.38,9.84 3.38,7.55 2.36,7.55

Small or netless copper shapes (teardrops, artwork), in the pictures only: 2 on Top Layer

## Text on the board
Bottom Silkscreen Layer: JLCJLCJLCJLC | GND | VCC
Top Silkscreen Layer: v1.0 | Hello LinHx | DC 5V-24V | 5V4A | HEART POWER | VCC | GND | ON | OFF
